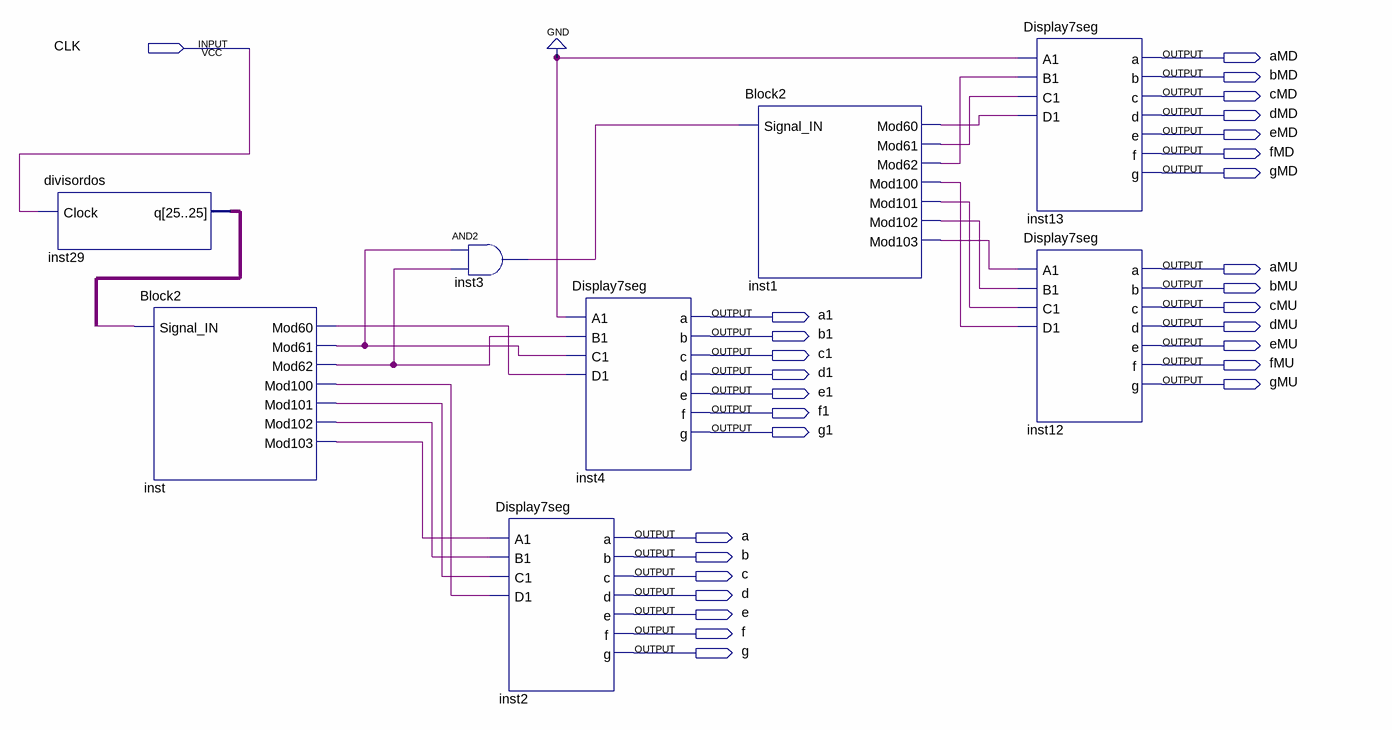
[diagram p0: schematic sheet]
// Quartus schematic Block3.bdf as structural Verilog: 8 symbols, 29 pins
module Block3 (
  input  CLK,
  output aMD,
  output bMD,
  output cMD,
  output dMD,
  output eMD,
  output fMD,
  output gMD,
  output aMU,
  output bMU,
  output cMU,
  output a1,
  output dMU,
  output b1,
  output eMU,
  output c1,
  output fMU,
  output d1,
  output gMU,
  output e1,
  output f1,
  output g1,
  output a,
  output b,
  output c,
  output d,
  output e,
  output f,
  output g
);

  wire inst1_mod60, inst1_mod61, inst1_mod62, inst1_mod100, inst1_mod101, inst1_mod102, inst1_mod103,
       inst3_out, inst29_q, inst_mod60, inst_mod61, inst_mod62, inst_mod100, inst_mod101, inst_mod102,
       inst_mod103;

  divisordos inst29 (.Clock(CLK), .q(inst29_q));
  Block2 inst (
    .Signal_IN(inst29_q), .Mod60(inst_mod60), .Mod61(inst_mod61), .Mod62(inst_mod62), .Mod100(inst_mod100),
    .Mod101(inst_mod101), .Mod102(inst_mod102), .Mod103(inst_mod103));
  and inst3 (inst3_out, inst_mod61, inst_mod62);
  Display7seg inst2 (
    .A1(inst_mod103), .B1(inst_mod102), .C1(inst_mod101), .D1(inst_mod100), .a(a), .b(b), .c(c), .d(d),
    .e(e), .f(f), .g(g));
  Display7seg inst4 (
    .A1(1'b0), .B1(inst_mod62), .C1(inst_mod61), .D1(inst_mod60), .a(a1), .b(b1), .c(c1), .d(d1), .e(e1),
    .f(f1), .g(g1));
  Block2 inst1 (
    .Signal_IN(inst3_out), .Mod60(inst1_mod60), .Mod61(inst1_mod61), .Mod62(inst1_mod62),
    .Mod100(inst1_mod100), .Mod101(inst1_mod101), .Mod102(inst1_mod102), .Mod103(inst1_mod103));
  Display7seg inst13 (
    .A1(1'b0), .B1(inst1_mod62), .C1(inst1_mod61), .D1(inst1_mod60), .a(aMD), .b(bMD), .c(cMD), .d(dMD),
    .e(eMD), .f(fMD), .g(gMD));
  Display7seg inst12 (
    .A1(inst1_mod103), .B1(inst1_mod102), .C1(inst1_mod101), .D1(inst1_mod100), .a(aMU), .b(bMU), .c(cMU),
    .d(dMU), .e(eMU), .f(fMU), .g(gMU));
endmodule
